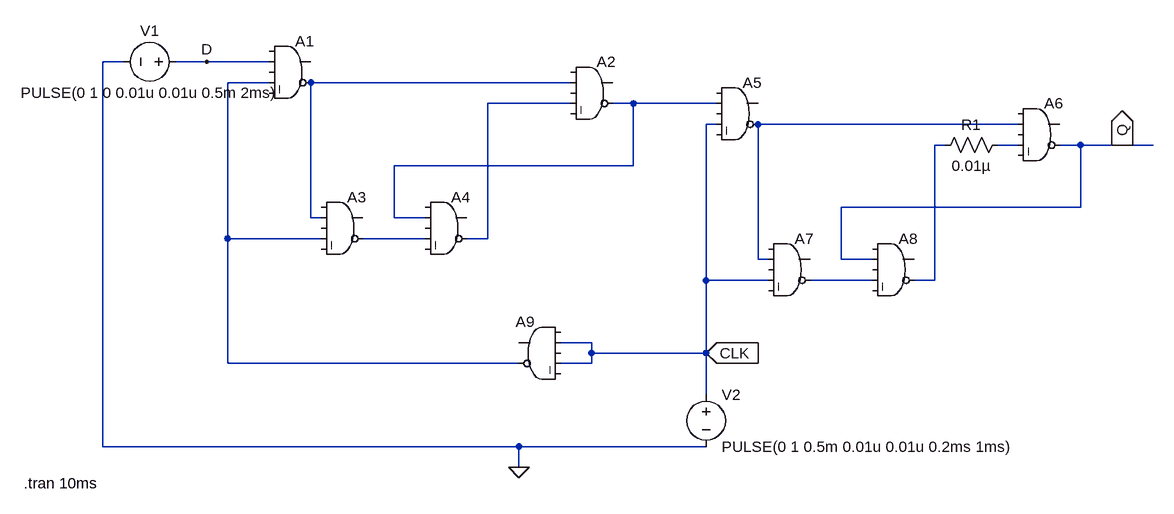
[diagram p0: schematic d flip flop with nand gates.asc]
d flip flop with nand gates.asc, the LTspice schematic file:
Version 4
SHEET 1 1508 840
WIRE -256 176 -288 176
WIRE -128 176 -176 176
WIRE -32 176 -128 176
WIRE -32 208 -96 208
WIRE 432 208 32 208
WIRE 432 240 304 240
WIRE 528 240 496 240
WIRE 656 240 528 240
WIRE 656 272 640 272
WIRE 1120 272 720 272
WIRE 1008 304 992 304
WIRE 1120 304 1088 304
WIRE 1216 304 1184 304
WIRE 1280 304 1216 304
WIRE 1328 304 1280 304
WIRE 528 336 528 240
WIRE 528 336 160 336
WIRE 1216 400 1216 304
WIRE 1216 400 848 400
WIRE 32 416 32 208
WIRE 48 416 32 416
WIRE 160 416 160 336
WIRE 208 416 160 416
WIRE -96 448 -96 208
WIRE 48 448 -96 448
WIRE 208 448 112 448
WIRE 304 448 304 240
WIRE 304 448 272 448
WIRE 720 480 720 272
WIRE 736 480 720 480
WIRE 848 480 848 400
WIRE 896 480 848 480
WIRE 640 512 640 272
WIRE 736 512 640 512
WIRE 896 512 800 512
WIRE 992 512 992 304
WIRE 992 512 960 512
WIRE 464 608 416 608
WIRE 464 624 464 608
WIRE 640 624 640 512
WIRE 640 624 464 624
WIRE -96 640 -96 448
WIRE 352 640 -96 640
WIRE 464 640 464 624
WIRE 464 640 416 640
WIRE 640 688 640 624
WIRE -288 768 -288 176
WIRE 352 768 -288 768
WIRE 640 768 352 768
WIRE 352 800 352 768
FLAG 640 624 CLK
IOPIN 640 624 In
FLAG 352 800 0
FLAG -128 176 D
FLAG 1280 304 Q
IOPIN 1280 304 Out
SYMBOL Digital\\and 0 128 R0
SYMATTR InstName A1
SYMBOL Digital\\and 464 160 R0
SYMATTR InstName A2
SYMBOL Digital\\and 80 368 R0
SYMATTR InstName A3
SYMBOL Digital\\and 240 368 R0
SYMATTR InstName A4
SYMBOL Digital\\and 384 560 M0
SYMATTR InstName A9
SYMBOL voltage -160 176 R90
WINDOW 0 -32 56 VBottom 2
WINDOW 3 32 56 VTop 2
WINDOW 123 0 0 Left 0
WINDOW 39 0 0 Left 0
SYMATTR InstName V1
SYMATTR Value PULSE(0 1 0 0.01u 0.01u 0.5m 2ms)
SYMBOL voltage 640 672 R0
WINDOW 123 0 0 Left 0
WINDOW 39 0 0 Left 0
SYMATTR InstName V2
SYMATTR Value PULSE(0 1 0.5m 0.01u 0.01u 0.2ms 1ms)
SYMBOL Digital\\and 688 192 R0
SYMATTR InstName A5
SYMBOL Digital\\and 1152 224 R0
SYMATTR InstName A6
SYMBOL Digital\\and 768 432 R0
SYMATTR InstName A7
SYMBOL Digital\\and 928 432 R0
SYMATTR InstName A8
SYMBOL res 1104 288 R90
WINDOW 0 0 56 VBottom 2
WINDOW 3 32 56 VTop 2
SYMATTR InstName R1
SYMATTR Value 0.01µ
TEXT -410 824 Left 2 !.tran 10ms

The netlist it stands for:
* d flip flop with nand gates.asc
A1 0 D 0 N001 0 N002 0 0 AND
A2 0 N002 0 N003 0 N004 0 0 AND
A3 0 N002 0 N001 0 N008 0 0 AND
A4 0 N004 0 N008 0 N003 0 0 AND
A9 0 CLK 0 CLK 0 N001 0 0 AND
V1 D 0 PULSE(0 1 0 0.01u 0.01u 0.5m 2ms)
V2 CLK 0 PULSE(0 1 0.5m 0.01u 0.01u 0.2ms 1ms)
A5 0 N004 0 CLK 0 N005 0 0 AND
A6 0 N005 0 N007 0 Q 0 0 AND
A7 0 N005 0 CLK 0 N009 0 0 AND
A8 0 Q 0 N009 0 N006 0 0 AND
R1 N007 N006 0.01µ
.tran 10ms
.backanno
.end